# EasyEDA schematic Arduino UNO Zeno Version_2021-05-13.json
TITLE: Sheet_1; REV: 1.0; Date: 2021-05-13; Sheet: 1/1; Drawn By: Sreeram AJ; Company: Your Company
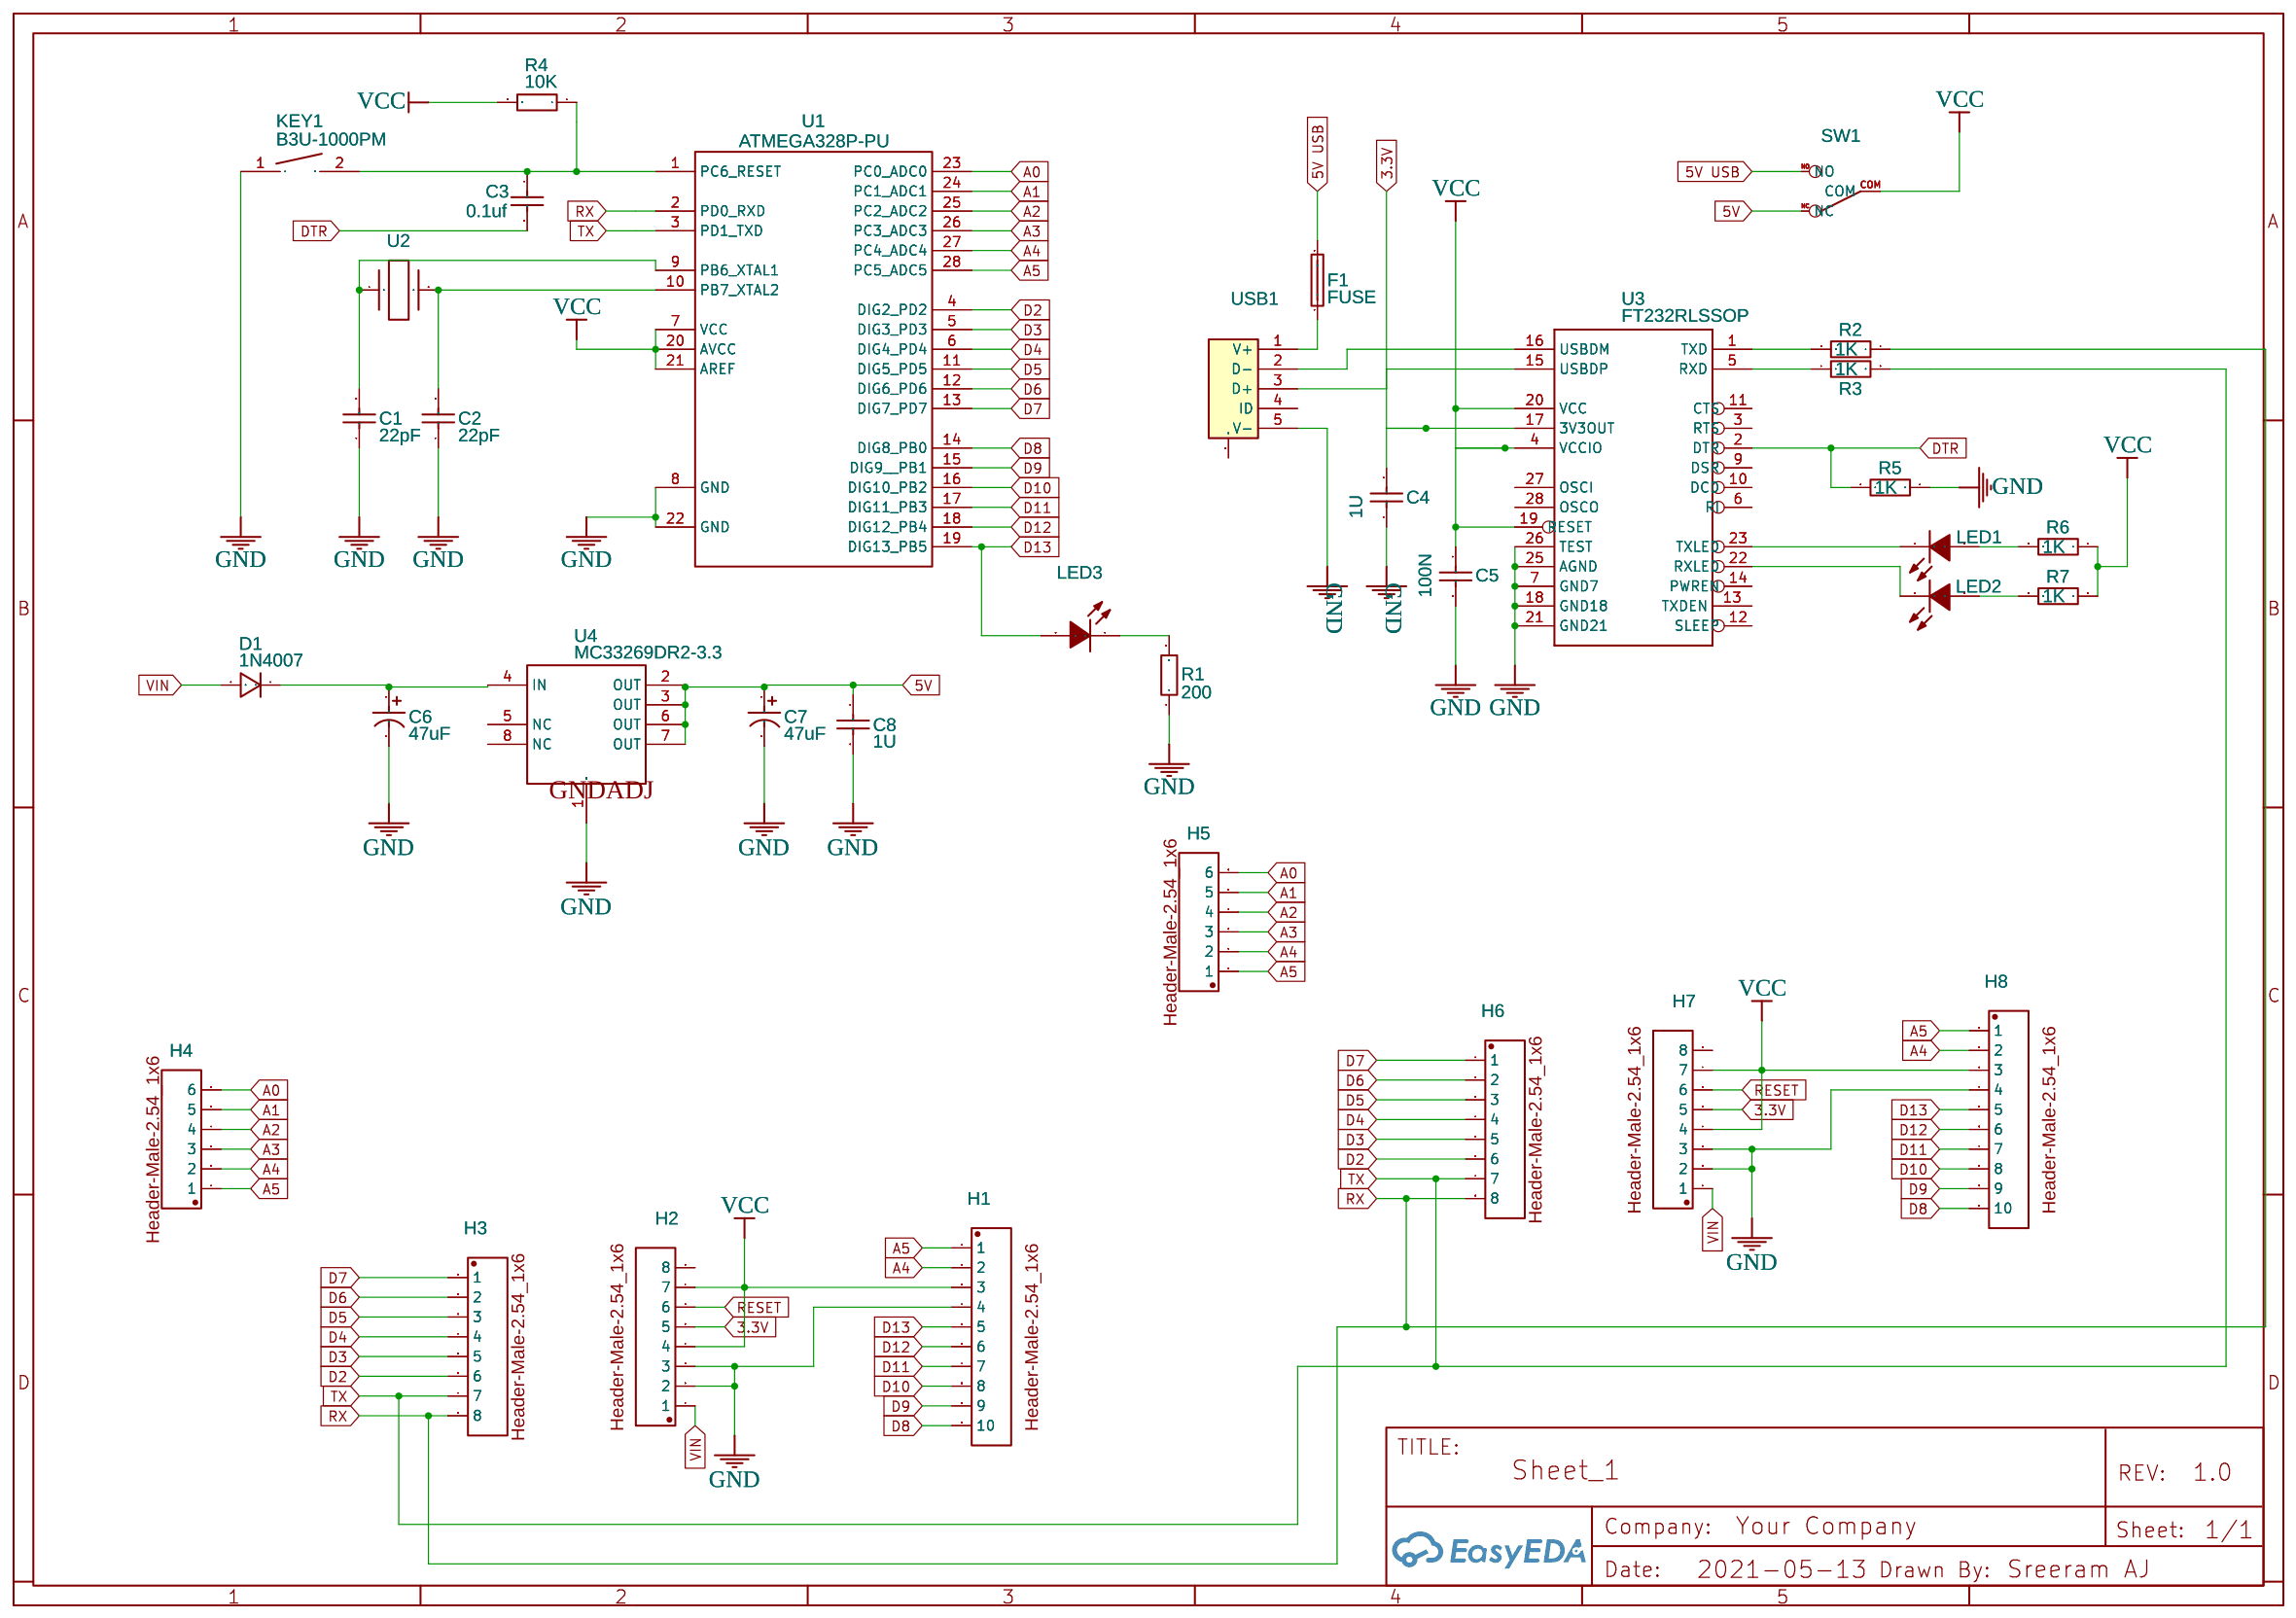
[diagram p0: schematic sheet]

## Parts
C1  22pF  [1206]
C2  22pF  [1206]
C3  0.1uf  [1206]
C4  1U  [1206]
C5  100N  [1206]
C6  47uF  [CAP-SMD_D8.00-L8.30-W8.30]
C7  47uF  [CAP-SMD_D8.00-L8.30-W8.30]
C8  1U  [1206]
D1  1N4007  [1N4007 SMD]
F1  FUSE  [F1812]
H1  Header-Male-2.54_1x10  [HEADER-MALE-2.54_1X10]
H2  HEADER-MALE-2.54_1X8  [HEADER-MALE-2.54_1X8]
H3  K  [HEADER-MALE-2.54_1X8]
H4  Header-Male-2.54_1x6  [HEADER-MALE-2.54_1X6]
H5  Header-Male-2.54_1x6  [HEADER-MALE-2.54_1X6]
H6  K  [HEADER-MALE-2.54_1X8]
H7  HEADER-MALE-2.54_1X8  [HEADER-MALE-2.54_1X8]
H8  Header-Male-2.54_1x10  [HEADER-MALE-2.54_1X10]
KEY1  B3U-1000PM  [KEY-SMD_B3U-1000PM]
LED1  LED SMD 0603  [LED0603-RD]
LED2  LED SMD 0603  [LED0603-RD]
LED3  LED SMD 0603  [LED0603-RD]
R1  200  [0603]
R2  1K  [0603]
R3  1K  [0603]
R4  10K  [0603]
R5  1K  [0603]
R6  1K  [0603]
R7  1K  [0603]
SW1  SW_SLIDE  [SLIDE_SWITCH_SMD]
U1  ATMEGA328P-PU  [DIP-28_L34.6-W7.3-P2.54-LS10.2-BL]
U2  Crystal resonator 12 MHz  [CRYSTAL RESONATOR 12MHZ]
U3  FT232RLSSOP  [SSOP28DB]
U4  MC33269DR2-3.3  [SOIC-8_L5.0-W4.0-P1.27-LS6.0-BL]
USB1  micro USBFemale  [MICRO-USB-SMD_5P-P0.65-H-F_C10418]

## Library data of the parts
C1-C5 C8 = CAPACITOR SMD  22pF 1206: Supplier: LCSC; Manufacturer: FH; Manufacturer Part: 1206CG220J500NT; Supplier Part: C1896
C6 C7 = PCE3946CT-ND 47UF 63V SMD CAPACITOR: Supplier Part: PCE3946CT-ND; Supplier: Digi-Key; Manufacturer: Panasonic; Manufacturer Part: EEE-1JA470UP; Operating Temperature: -40℃~+85℃; Rated Voltage: 63V; Tolerance: ±20%; Contributor: alexackerman96
D1 = DIODE 1N4007 SMD 5X2.56: Supplier: LCSC; Supplier Part: C126233; Manufacturer: SK; Contributor: mark.sergey; LCSC Assembly: Yes; SMT Type: Extend
F1 = 1812L020PR: Supplier: LCSC; Supplier Part: C151167; Manufacturer: Littelfuse; Contributor: LCSC
H1 H8 = Header-Male-2.54_1x10: Contributor: Destiny
H2 H3 H6 H7 = HEADER-MALE-2.54_1X8: Contributor: Destiny
H4 H5 = Header-Male-2.54_1x6: Contributor: Destiny
KEY1 = B3U-1000PM: Supplier: LCSC; Supplier Part: C271754; Manufacturer: Omron Electronics; Contributor: LCSC
LED1-LED3 = LED SMD 0603
R1-R7 = 1k Resistor SMD 0603 (C73797): Supplier Part: C73797; Supplier: LCSC; Manufacturer: FH; Manufacturer Part: RS-03K102JT
SW1 = SW_SLIDE: Contributor: DangerousPrototype
U1 = ATMEGA328P-PU: sourceId: Oic6oiASL; Supplier: LCSC; Manufacturer: MICROCHIP; image: //image.lceda.cn/szlcsc/C33901.jpg; Contributor: LCSC; Supplier Part: C33901
U2 = Crystal resonator 12 MHz: Contributor: HESPzIroN
U3 = FT232RLSSOP: USB UART; Contributor: SparkFun
U4 = MC33269DR2-3.3: Supplier: LCSC; Manufacturer: ON; image: //image.lceda.cn/szlcsc/C7301.jpg; Supplier Part: C7301; JLCPCB Part Class: Extended Part
USB1 = micro USBFemale: Supplier: LCSC; Manufacturer: ValuePro; image: //image.lceda.cn/szlcsc/C10418.jpg; Supplier Part: C10418

## Nets
3.3V: C4.2 H2.5 H7.5 U3.17(3V3OUT)
5V: C7.1 C8.1 SW1.NC U4.2(OUT) U4.3(OUT) U4.6(OUT) U4.7(OUT)
5V USB: F1.2 SW1.NO
GND: C1.1 C2.1 C4.1 C5.2 C6.2 C7.2 C8.2 H1.4 H2.2 H2.3 H7.2 H7.3 H8.4 KEY1.1 R1.1 R5.1 U1.8(GND) U1.22(GND) U3.7(GND7) U3.18(GND18) U3.21(GND21) U3.25(AGND) U3.26(TEST) U4.1(GNDADJ) USB1.5(V-)
VCC: C5.1 H1.3 H2.4 H2.7 H7.4 H7.7 H8.3 R4.2 R6.1 R7.1 SW1.COM U1.7(VCC) U1.20(AVCC) U1.21(AREF) U3.4(VCCIO) U3.19(RESET) U3.20(VCC)
VIN: D1.2 H2.1 H7.1
A0: H4.6 H5.6 U1.23(PC0 ADC0)
A1: H4.5 H5.5 U1.24(PC1 ADC1)
A2: H4.4 H5.4 U1.25(PC2 ADC2)
A3: H4.3 H5.3 U1.26(PC3 ADC3)
A4: H1.2 H4.2 H5.2 H8.2 U1.27(PC4 ADC4)
A5: H1.1 H4.1 H5.1 H8.1 U1.28(PC5 ADC5)
D2: H3.6 H6.6 U1.4(DIG2 PD2)
D3: H3.5 H6.5 U1.5(DIG3 PD3)
D4: H3.4 H6.4 U1.6(DIG4 PD4)
D5: H3.3 H6.3 U1.11(DIG5 PD5)
D6: H3.2 H6.2 U1.12(DIG6 PD6)
D7: H3.1 H6.1 U1.13(DIG7 PD7)
D8: H1.10 H8.10 U1.14(DIG8 PB0)
D9: H1.9 H8.9 U1.15(DIG9  PB1)
D10: H1.8 H8.8 U1.16(DIG10 PB2)
D11: H1.7 H8.7 U1.17(DIG11 PB3)
D12: H1.6 H8.6 U1.18(DIG12 PB4)
D13: H1.5 H8.5 LED3.2(A) U1.19(DIG13 PB5)
DTR: C3.2 R5.2 U3.2(DTR)
RESET: H2.6 H7.6
RX: H3.8 H6.8 R2.1 U1.2(PD0 RXD)
TX: H3.7 H6.7 R3.2 U1.3(PD1 TXD)
Net-(C1-2): C1.2 U1.9(PB6 XTAL1) U2.1
Net-(C2-2): C2.2 U1.10(PB7 XTAL2) U2.2
Net-(C3-1): C3.1 KEY1.2 R4.1 U1.1(PC6 RESET)
Net-(C6-1): C6.1 D1.1 U4.4(IN)
Net-(F1-1): F1.1 USB1.1(V+)
Net-(LED1-1): LED1.1(K) U3.23(TXLED)
Net-(LED1-2): LED1.2(A) R6.2
Net-(LED2-1): LED2.1(K) U3.22(RXLED)
Net-(LED2-2): LED2.2(A) R7.2
Net-(LED3-1): LED3.1(K) R1.2
Net-(R2-2): R2.2 U3.1(TXD)
Net-(R3-1): R3.1 U3.5(RXD)
Net-(U3-15): U3.15(USBDP) USB1.3(D+)
Net-(U3-16): U3.16(USBDM) USB1.2(D-)

Not connected (* = marked no-connect by the designer): H2 8; H7 8; U3 3(RTS) 6(RI) 9(DSR) 10(DCD) 11(CTS) 12(SLEEP) 13(TXDEN) 14(PWREN) 27(OSCI) 28(OSCO); U4 5(NC) 8(NC); USB1 0(MTN) 4(ID)
